# EAGLE design LittleBluePenguin (EAGLE 7.7.0)
LBP PCB Adapter board for the Intel Edison module.

## Sheet 1 of 2
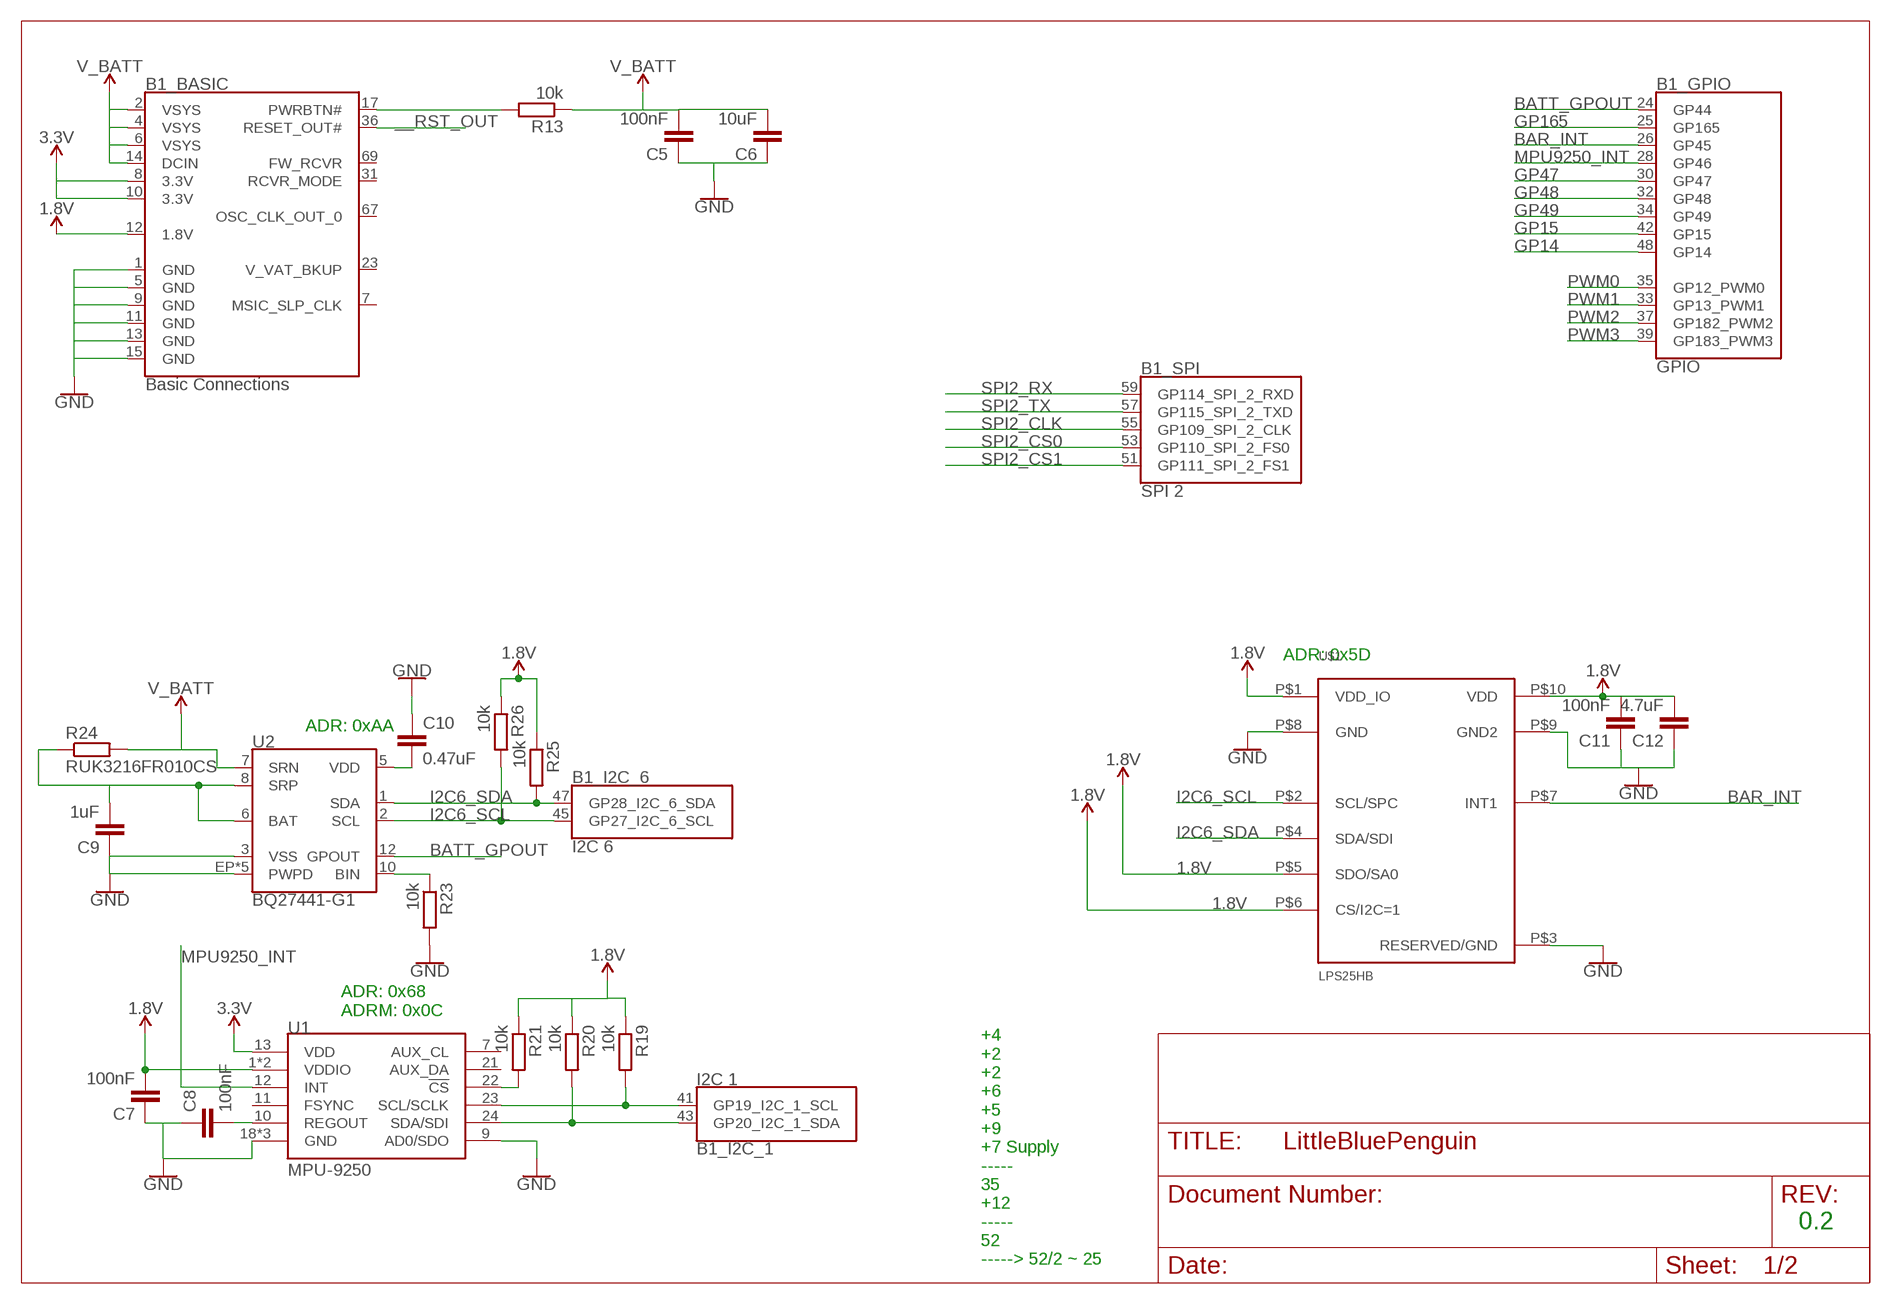
[diagram p0: schematic, sheet 1]

### Parts
B1  SPARKFUN_EDISON  [SPARKFUN_EDISON_DAUGHTER]
C5  100nF  C-EUC0603K  [C0603K]
C6  10uF  C-EUC0603K  [C0603K]
C7  100nF  C-EUC0603K  [C0603K]
C8  100nF  C-EUC0603K  [C0603K]
C9  1uF  C-EUC0603K  [C0603K]
C10  0.47uF  C-EUC0603K  [C0603K]
C11  100nF  C-EUC0603K  [C0603K]
C12  4.7uF  C-EUC0603K  [C0603K]
R13  10k  R-EU_R0603  [R0603]
R19  10k  R-EU_R0603  [R0603]
R20  10k  R-EU_R0603  [R0603]
R21  10k  R-EU_R0603  [R0603]
R23  10k  R-EU_R0603  [R0603]
R24  RUK3216FR010CS  R-EU_R1206  [R1206]
R25  10k  R-EU_R0603  [R0603]
R26  10k  R-EU_R0603  [R0603]
U1  MPU-9250  [QFN24_PAD]
U2  BQ27441-G1  [PDSO-N12]
U$1  LPS25HB  [HLGA-10L]

### Nets
1.8V: B1.12(_BASIC:1.8V) C7.2 C11.2 C12.2 R19.1 R20.1 R21.1 R25.1 R26.1 U1.1(VDDIO) U1.8(VDDIO) U$1.P$1(VDD_IO) U$1.P$5(SDO/SA0) U$1.P$6(CS/I2C=1) U$1.P$10(VDD) ; also sheet 2
3.3V: B1.8(_BASIC:3.3V) B1.10(_BASIC:3.3V) U1.13(VDD) ; also sheet 2
__RST_OUT: B1.36(_BASIC:RESET_OUT#) ; also sheet 2
BAR_INT: B1.26(_GPIO:GP45) U$1.P$7(INT1)
BATT_GPOUT: B1.24(_GPIO:GP44) U2.12(GPOUT)
BATT_IN: C9.2 R24.1 U2.6(BAT) U2.8(SRP) ; also sheet 2
GND: B1.1(_BASIC:GND) B1.5(_BASIC:GND) B1.9(_BASIC:GND) B1.11(_BASIC:GND) B1.13(_BASIC:GND) B1.15(_BASIC:GND) C5.1 C6.1 C7.1 C8.1 C9.1 C10.1 C11.1 C12.1 R23.2 U1.9(AD0/SDO) U1.18(GND) U1.20(GND) U1.CENTER(GND) U2.3(VSS) U2.EP1(PWPD) U2.EP2(PWPD) U2.EP3(PWPD) U2.EP4(PWPD) U2.EP(PWPD) U$1.P$3(RESERVED/GND) U$1.P$8(GND) U$1.P$9(GND2) ; also sheet 2
GP14: B1.48(_GPIO:GP14)
GP15: B1.42(_GPIO:GP15)
GP47: B1.30(_GPIO:GP47)
GP48: B1.32(_GPIO:GP48)
GP49: B1.34(_GPIO:GP49)
GP165: B1.25(_GPIO:GP165)
I2C1_SCL: B1.41(_I2C_1:GP19_I2C_1_SCL) R19.2 U1.23(SCL/SCLK)
I2C1_SDA: B1.43(_I2C_1:GP20_I2C_1_SDA) R20.2 U1.24(SDA/SDI)
I2C6_SCL: B1.45(_I2C_6:GP27_I2C_6_SCL) R26.2 U2.2(SCL) U$1.P$2(SCL/SPC) ; also sheet 2
I2C6_SDA: B1.47(_I2C_6:GP28_I2C_6_SDA) R25.2 U2.1(SDA) U$1.P$4(SDA/SDI) ; also sheet 2
MPU9250_INT: B1.28(_GPIO:GP46) U1.12(INT)
N$15: R23.1 U2.10(BIN)
N$16: B1.17(_BASIC:PWRBTN#) R13.2
N$17: C8.2 U1.10(REGOUT)
N$20: R21.2 U1.22(!CS)
N$22: C10.2 U2.5(VDD)
PWM0: B1.35(_GPIO:GP12_PWM0) ; also sheet 2
PWM1: B1.33(_GPIO:GP13_PWM1) ; also sheet 2
PWM2: B1.37(_GPIO:GP182_PWM2) ; also sheet 2
PWM3: B1.39(_GPIO:GP183_PWM3) ; also sheet 2
SPI2_CLK: B1.55(_SPI:GP109_SPI_2_CLK)
SPI2_CS0: B1.53(_SPI:GP110_SPI_2_FS0)
SPI2_CS1: B1.51(_SPI:GP111_SPI_2_FS1)
SPI2_RX: B1.59(_SPI:GP114_SPI_2_RXD)
SPI2_TX: B1.57(_SPI:GP115_SPI_2_TXD)
V_BATT: B1.2(_BASIC:VSYS) B1.4(_BASIC:VSYS) B1.6(_BASIC:VSYS) B1.14(_BASIC:DCIN) C5.2 C6.2 R13.1 R24.2 U2.7(SRN) ; also sheet 2
Unconnected: B1.7(_BASIC:MSIC_SLP_CLK) B1.31(_BASIC:RCVR_MODE) B1.67(_BASIC:OSC_CLK_OUT_0) B1.69(_BASIC:FW_RCVR) U1.7(AUX_CL) U1.11(FSYNC) U1.21(AUX_DA)

### Notes on the sheet
- ADR: 0x5D
- ADR: 0xAA
- ADR: 0x68
  ADRM: 0x0C
- 0.2
- +4
  +2
  +2
  +6
  +5
  +9
  +7 Supply
  -----
  35
  +12
  -----
  52
  -----> 52/2 ~ 25

## Sheet 2 of 2
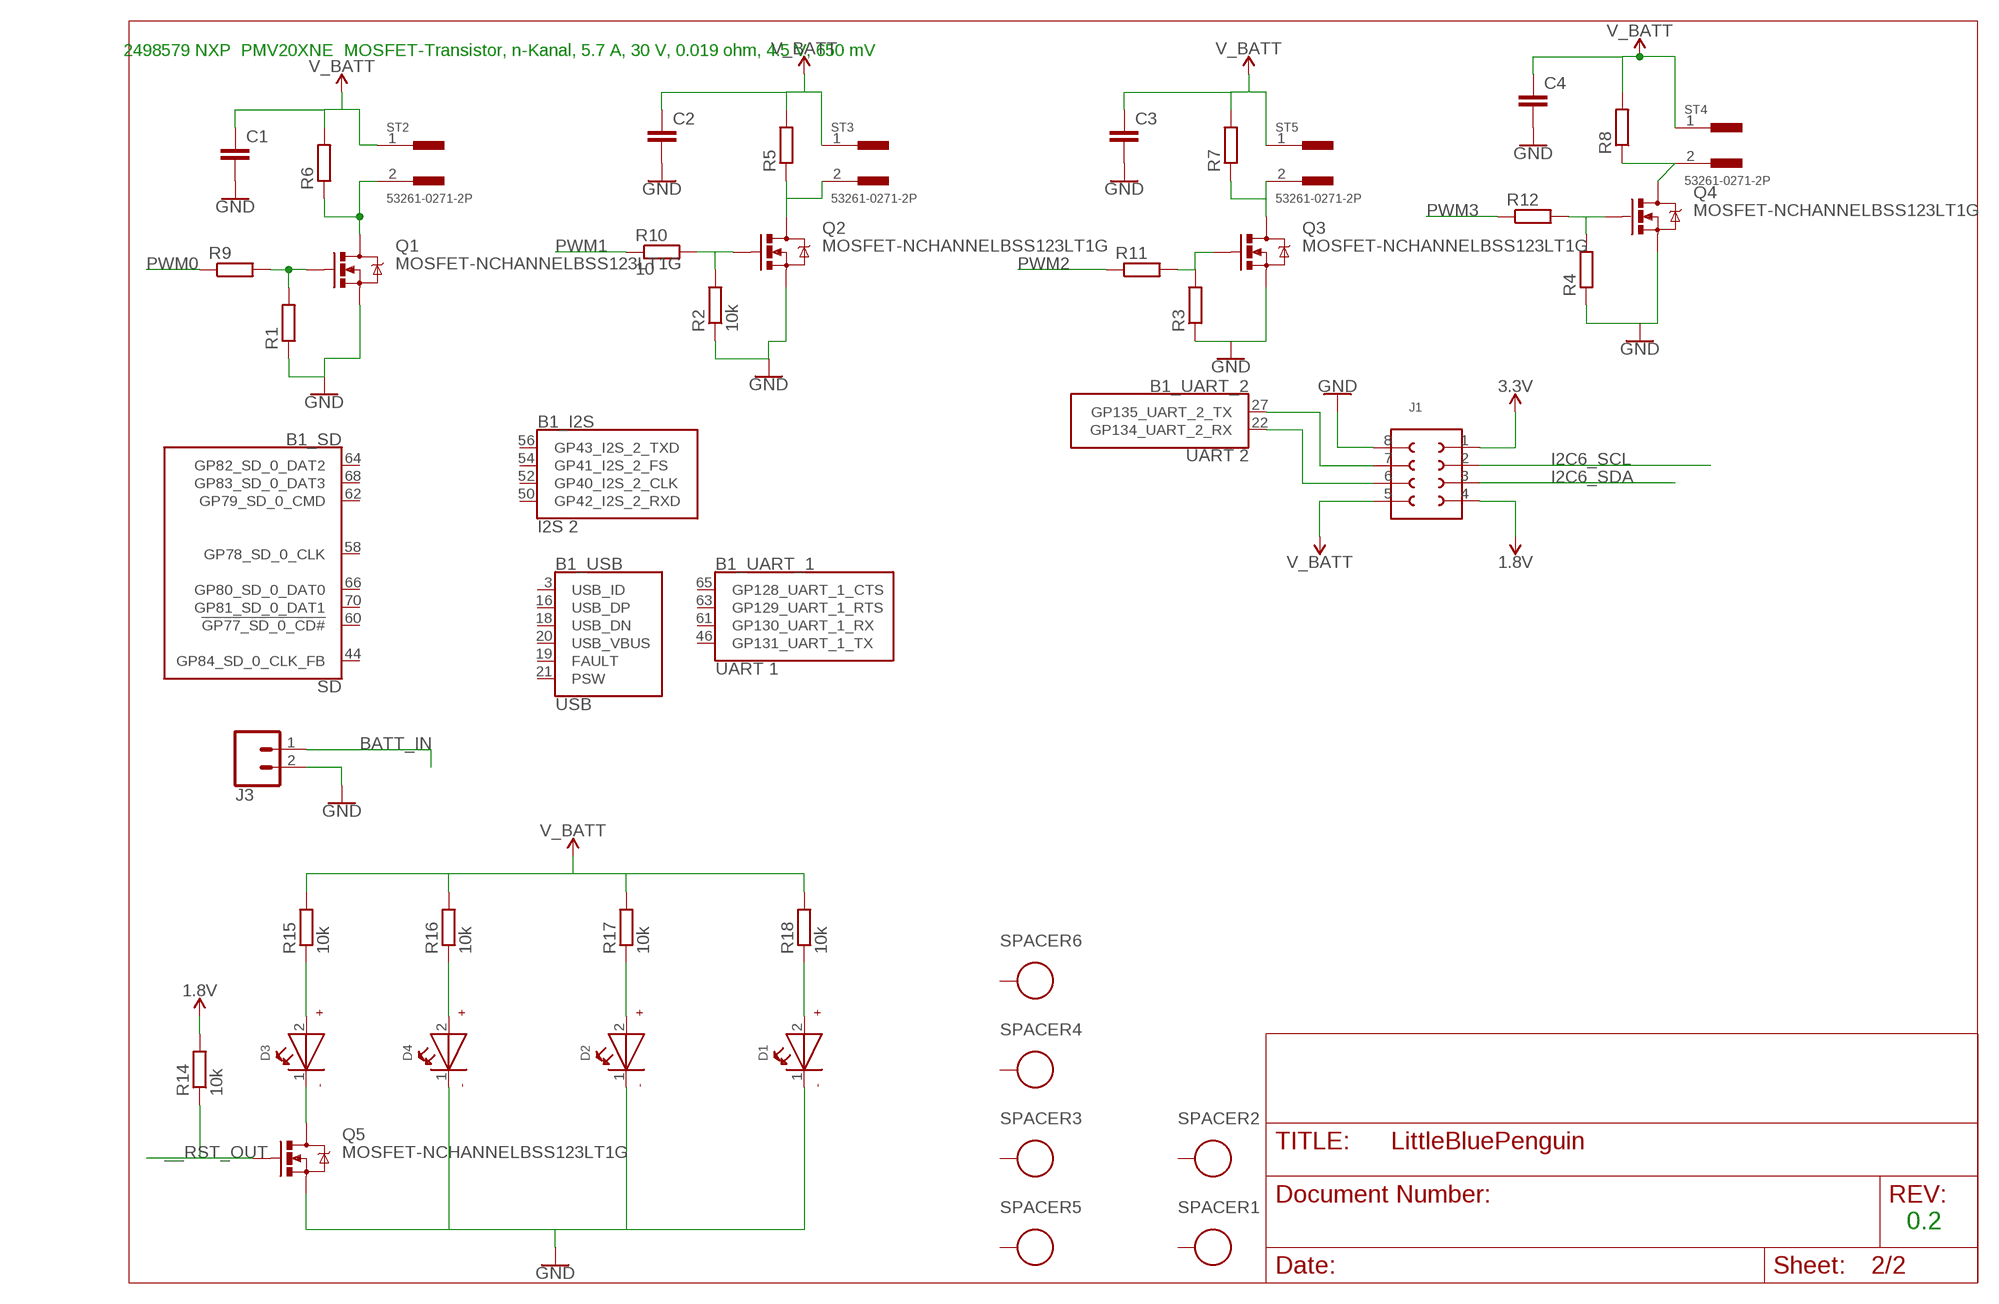
[diagram p1: schematic, sheet 2]

### Parts
C1  C-EUC0603K  [C0603K]
C2  C-EUC0603K  [C0603K]
C3  C-EUC0603K  [C0603K]
C4  C-EUC0603K  [C0603K]
D1  WL-SMSW155124GS73200-G  [1204]
D2  WL-SMSW155124GS73200-G  [1204]
D3  WL-SMSW155124GS73200-G  [1204]
D4  WL-SMSW155124GS73200-G  [1204]
J1  623X0821021  [623X0821021]
J3  CONN_02JST-PTH-2  [JST-2-PTH]
Q1  MOSFET-NCHANNELBSS123LT1G  [SOT23-3]
Q2  MOSFET-NCHANNELBSS123LT1G  [SOT23-3]
Q3  MOSFET-NCHANNELBSS123LT1G  [SOT23-3]
Q4  MOSFET-NCHANNELBSS123LT1G  [SOT23-3]
Q5  MOSFET-NCHANNELBSS123LT1G  [SOT23-3]
R1  R-EU_R0603  [R0603]
R2  10k  R-EU_R0603  [R0603]
R3  R-EU_R0603  [R0603]
R4  R-EU_R0603  [R0603]
R5  R-EU_R0603  [R0603]
R6  R-EU_R0603  [R0603]
R7  R-EU_R0603  [R0603]
R8  R-EU_R0603  [R0603]
R9  R-EU_R0603  [R0603]
R10  10  R-EU_R0603  [R0603]
R11  R-EU_R0603  [R0603]
R12  R-EU_R0603  [R0603]
R14  10k  R-EU_R0603  [R0603]
R15  10k  R-EU_R0603  [R0603]
R16  10k  R-EU_R0603  [R0603]
R17  10k  R-EU_R0603  [R0603]
R18  10k  R-EU_R0603  [R0603]
SPACER1  WA-SMSI_9774243  [WA-SMSI_9774***243]
SPACER2  WA-SMSI_9774243  [WA-SMSI_9774***243]
SPACER3  WA-SMSI_9774360  [WA-SMSI_9774***360]
SPACER4  WA-SMSI_9774360  [WA-SMSI_9774***360]
SPACER5  WA-SMSI_9774360  [WA-SMSI_9774***360]
SPACER6  WA-SMSI_9774360  [WA-SMSI_9774***360]
ST2  53261-0271-2P  [53261-0271]
ST3  53261-0271-2P  [53261-0271]
ST4  53261-0271-2P  [53261-0271]
ST5  53261-0271-2P  [53261-0271]

### Nets
1.8V: J1.4 R14.2 ; also sheet 1
3.3V: J1.1 ; also sheet 1
__RST_OUT: Q5.1(G) R14.1 ; also sheet 1
BATT_IN: J3.1 ; also sheet 1
GND: C1.2 C2.2 C3.2 C4.2 D1.1(-) D2.1(-) D4.1(-) J1.8 J3.2 Q1.2(S) Q2.2(S) Q3.2(S) Q4.2(S) Q5.2(S) R1.1 R2.1 R3.1 R4.1 ; also sheet 1
I2C6_SCL: J1.2 ; also sheet 1
I2C6_SDA: J1.3 ; also sheet 1
N$1: Q3.1(G) R3.2 R11.2
N$2: Q1.3(D) R6.1 ST2.2
N$3: D3.1(-) Q5.3(D)
N$4: D3.2(+) R15.1
N$5: Q1.1(G) R1.2 R9.2
N$6: Q2.1(G) R2.2 R10.2
N$7: Q3.3(D) R7.1 ST5.2
N$8: Q2.3(D) R5.1 ST3.2
N$9: D4.2(+) R16.1
N$10: D2.2(+) R17.1
N$11: Q4.1(G) R4.2 R12.2
N$12: Q4.3(D) R8.1 ST4.2
N$14: D1.2(+) R18.1
N$50: B1.27(_UART_2:GP135_UART_2_TX) J1.7
N$51: B1.22(_UART_2:GP134_UART_2_RX) J1.6
PWM0: R9.1 ; also sheet 1
PWM1: R10.1 ; also sheet 1
PWM2: R11.1 ; also sheet 1
PWM3: R12.1 ; also sheet 1
V_BATT: C1.1 C2.1 C3.1 C4.1 J1.5 R5.2 R6.2 R7.2 R8.2 R15.2 R16.2 R17.2 R18.2 ST2.1 ST3.1 ST4.1 ST5.1 ; also sheet 1
Unconnected: B1.3(_USB:USB_ID) B1.16(_USB:USB_DP) B1.18(_USB:USB_DN) B1.19(_USB:FAULT) B1.20(_USB:USB_VBUS) B1.21(_USB:PSW) B1.44(_SD:GP84_SD_0_CLK_FB) B1.46(_UART_1:GP131_UART_1_TX) B1.50(_I2S:GP42_I2S_2_RXD) B1.52(_I2S:GP40_I2S_2_CLK) B1.54(_I2S:GP41_I2S_2_FS) B1.56(_I2S:GP43_I2S_2_TXD) B1.58(_SD:GP78_SD_0_CLK) B1.60(_SD:!GP77_SD_0_CD#) B1.61(_UART_1:GP130_UART_1_RX) B1.62(_SD:GP79_SD_0_CMD) B1.63(_UART_1:GP129_UART_1_RTS) B1.64(_SD:GP82_SD_0_DAT2) B1.65(_UART_1:GP128_UART_1_CTS) B1.66(_SD:GP80_SD_0_DAT0) B1.68(_SD:GP83_SD_0_DAT3) B1.70(_SD:GP81_SD_0_DAT1) SPACER1.1 SPACER2.1 SPACER3.1 SPACER4.1 SPACER5.1 SPACER6.1

### Notes on the sheet
- 2498579 NXP  PMV20XNE  MOSFET-Transistor, n-Kanal, 5.7 A, 30 V, 0.019 ohm, 4.5 V, 650 mV
- 0.2

## Power pins joined to a net without a drawn wire
V_VAT_BKUP: B1.23(_BASIC:V_VAT_BKUP)

## Library data of the parts
B1 = SparkFun-Boards:SPARKFUN_EDISON: SparkFun Edison The Intel® Edison is an ultra small computing platform that will change the way you look at embedded electronics. Each Edison packs a huge amount of tech goodies into a tiny package while still providing the same robust strength of your go-to single board computer. Powered by the Intel® Atom™ SoC dual-core CPU and including an integrated WiFi, Bluetooth LE, and a 70-pin connector to attach a veritable slew of shield-like “Blocks” which can be stacked on top of each other. This device includes footprints for the Edison module itself, as well as the basic board outline used for our Edison blocks. SparkFun Products: Intel Edison <https://www.sparkfun.com/products/13024> SparkFun Console Block <https://www.sparkfun.com/products/13039> SparkFun GPIO Block <https://www.sparkfun.com/products/13038> SparkFun Battery Block <https://www.sparkfun.com/products/13037> SparkFun Base Block <https://www.sparkfun.com/products/13045> SparkFun 9DOF Block <https://www.sparkfun.com/products/13033> SparkFun OLED Block <https://www.sparkfun.com/products/13035> SparkFun Dual H-Bridge Block <https://www.sparkfun.com/products/13043> SparkFun microSD Block <https://www.sparkfun.com/products/13041> SparkFun ADC Block <https://www.sparkfun.com/products/13770> SparkFun I2C Block <https://www.sparkfun.com/products/13034> SparkFun Arduino Block <https://www.sparkfun.com/products/13036> SparkFun Power Block <https://www.sparkfun.com/products/13727> SparkFun PWM Block <https://www.sparkfun.com/products/13042> SparkFun Raspberry Pi Block <https://www.sparkfun.com/products/13044> SparkFun UART Block <https://www.sparkfun.com/products/13040>
C1-C12 = rcl:C-EU: CAPACITOR, European symbol
D1-D4 = EAGLE-COLOR_LED-rev16a:WL-SMSW: SMD Side view mono-color round Characteristics Low power consumption High reliability Low current requirement No UV/IR radiation Wide viewing angle Excelllent for edge lighting displays and backlighting indicators Ideal for miniature applications PBC high-usage Compatible with automatic placement equipment Applications Backlighting for LCD Sidelighting applications Indicator and backlighting for telecommunication Backlighting for symbol, switch and dashboard General use <http://katalog.we-online.de/media/images/eipal/WL-SMSW_pf2.jpg> Details see: http://katalog.we-online.de/en/led/WL-SMSW?m Updated: 2015-04-10 2015 (C) Wurth Elektronik; COMPANY-URL: http://www.we-online.de; CREATED-BY: Christin Otto; CREATED-DATE: APR 2013; DATASHEET-URL: http://katalog.we-online.de/en/led/WL-SMSW?m=t&sq=smsw&sp=&sp=http%3A%2F%2Fwww.we-online.de%2Fweb%2Fen%2Felectronic_components%2Fsearchpage_PBS.php%3Fsearch%3Dsmsw#vs_t2:2; MANUFACTURER: Würth Elektronik eiSos GmbH
J1 = EAGLE-BOARD-TO-BOARD_CONNECTORS-rev16c:623X0821021: WR-PHD 1.27mm Dual SMT Socket Header H=4.50mm, 8 Pins=>Code : Con_BTB_SHD_1.27_2_623x0821021(Packaging:x = 0: Tube x = 3: Tape & Reel with Cap) <http://katalog.we-online.de/media/thumbs2/eican/thb_Con_BTB_SHD_1.27_2_6230xx21021_pf2.jpg> 6230xx21021 Details see: http://katalog.we-online.de/en/em/PHD_1_27_SMT_DUAL_SOCKET_HEADER_6230XX21021 6233xx21021 Details see: http://katalog.we-online.de/en/em/PHD_1_27_SMT_DUAL_SOCKET_HEADER_REEL_6233XX21021 2014 (C) Würth Elektronik
J3 = SparkFun-Connectors:CONN_02: Multi connection point. Often used as Generic Header-pin footprint for 0.1 inch spaced/style header connections On any of the 0.1 inch spaced packages, you can populate with these: Break Away Headers - Straight <https://www.sparkfun.com/products/116> (PRT-00116) Break Away Male Headers - Right Angle <https://www.sparkfun.com/products/553> (PRT-00553) Female Headers <https://www.sparkfun.com/products/115> (PRT-00115) Break Away Headers - Machine Pin <https://www.sparkfun.com/products/117> (PRT-00117) Break Away Female Headers - Swiss Machine Pin <https://www.sparkfun.com/products/743> (PRT-00743) For SCREWTERMINALS and SPRING TERMINALS visit here: Screw Terimnals on SparkFun.com <https://www.sparkfun.com/search/results?term=Screw+Terminals> (5mm/3.5mm/2.54mm spacing) This device is also useful as a general connection point to wire up your design to another part of your project. Our various solder wires solder well into these plated through hole pads. Hook-Up Wire - Assortment (Stranded, 22 AWG) <https://www.sparkfun.com/products/11375> (PRT-11375) Hook-Up Wire - Assortment (Solid Core, 22 AWG) <https://www.sparkfun.com/products/11367> (PRT-11367) View the entire wire category on our website here <https://www.sparkfun.com/categories/141> Special notes: Molex polarized connector foot print use with: PRT-08233 with associated crimp pins and housings. 2.54_SCREWTERM for use with PRT-10571. 3.5mm Screw Terminal footprints for PRT-08084 5mm Screw Terminal footprints for use with PRT-08432; PROD_ID: CONN-09863; SKU: PRT-09914
Q1-Q5 = SparkFun-DiscreteSemi:MOSFET-NCHANNEL: Common NMOSFET Parts MFG P/N Store ID Prod ID FDD8780 TRANS-09984 SI7820DN TRANS-11055 FDS6630A IC-08089 2N7002PW TRANS-11151 FQP30N06L COM-10213 TRANS-10060 BSS123LT1G TRANS-08345 BSS138 TRANS-00830 BS170 2N7000; PROD_ID: TRANS-08345
R1-R21 R23-R26 = rcl:R-EU_: RESISTOR, European symbol
SPACER1 SPACER2 = EAGLE-SPACER_STUDS_&_ROUND_SPACERS_1-rev16b:WA-SMSI_9774***243: WA-SMSI SMT Steel Spacer, M2 Thread Internal Characteristics Thread M2 Material:Steel Surface:Tin Outer Diameter 4.35 mm Inner Diameter 2.7 mm <http://katalog.we-online.de/media/images/v2/Single_SMD-Abstandsbolzen(3).jpg> Details see: http://katalog.we-online.de/en/em/SMSI_SMT_STEEL_SPACER_M2_THREAD_INTERNAL/S 2015 (C) Wurth Elektronik
SPACER3-SPACER6 = EAGLE-SPACER_STUDS_&_ROUND_SPACERS_1-rev16b:WA-SMSI_9774***360: WA-SMSI SMT Steel Spacer, M3 Thread Internal Characteristics Thread M3 Material:Steel Surface:Tin Outer Diameter 6 mm Inner Diameter 4.2 mm <http://katalog.we-online.de/media/images/v2/Single_SMD-Abstandsbolzen(3).jpg> Details see: http://katalog.we-online.de/en/em/SMSI_SMT_STEEL_SPACER_M3_THREAD_INTERNAL/S 2015 (C) Wurth Elektronik
ST2-ST5 = H-Molex:53261-0271-2P: PicoBlade 53261 / RM1.25mm /mates with 51021 Series
U1 = SparkFun_MPU-9250_Breakout:MPU-9250: NC pin 19. 2-6 & 14-17 not internally connected. May be used for PCB trace routing.; PROD_ID: IC-13192
U2 = battery-management-temp:BQ27441-G1
U$1 = 0_st_LPS25HB:LPS25HB: LPS25HB Digi-Key: 497-15070-1-ND

## Board
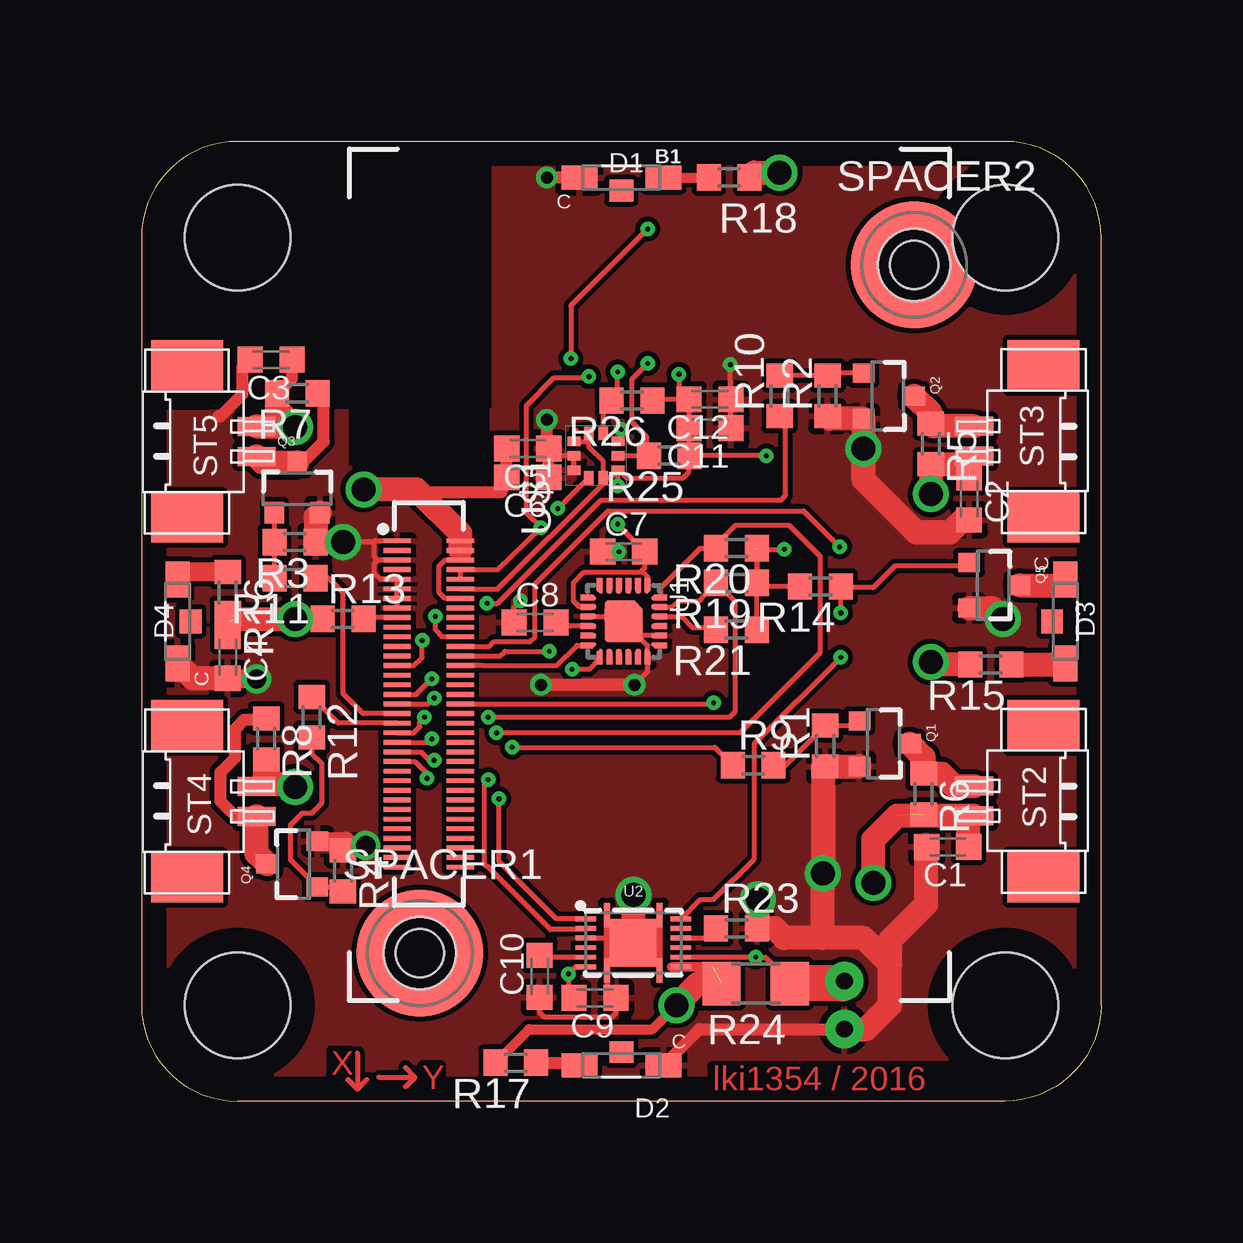
[diagram p2: board, top side]
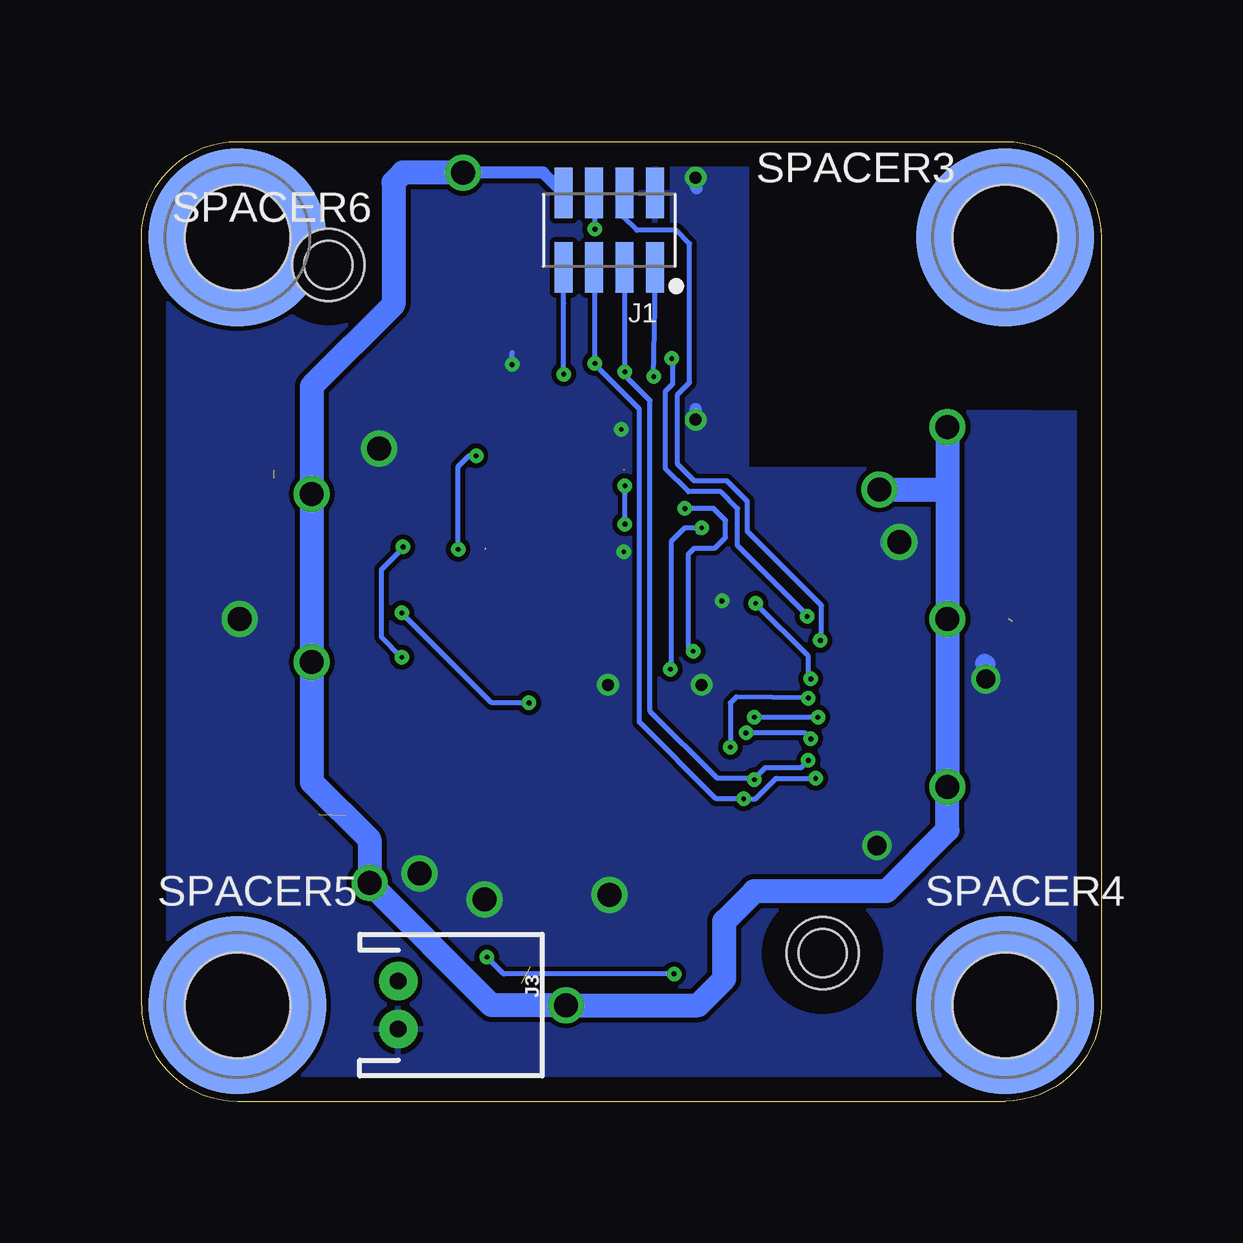
[diagram p3: board, bottom side, seen from below]

Size 40 x 40 mm. Coordinates in mm from the lower left corner, seen from the top.
Outline: 0,36 0,4 arc90 4,0 36,0 arc90 40,4 40,36 arc90 36,40 4,40 arc90 0,36
Copper layers (1*16): Top 0.035mm / dielectric 1.5mm / Bottom 0.035mm
Design rules "default *": minimum track width 0.1mm, minimum drill 0.1mm, track to track 8mil, track to pad 8mil, pad to pad 8mil, via to via 8mil, smd to smd 8mil, copper to edge 40mil, drill to drill 8mil, minimum pad ring 10mil, minimum via ring 8mil, stop-mask expansion 4mil, vias tented up to drill 0mil, thermal gap 10mil
tRestrict: area 8.6,26.5 to 14.5,39.9
bRestrict: area 8.5,26.4 to 14.6,39.9

### Footprints (pad centres in the part's own frame; a part is rotated, then mirrored left to right if it is on the bottom)
SPARKFUN_EDISON_DAUGHTER = smd 1.14 x 0.2: 1 -11.99,1.39; 2 -9.35,1.39; 3 -11.99,0.99; 4 -9.35,0.99; 5 -11.99,0.59; 6 -9.35,0.59; 7 -11.99,0.19; 8 -9.35,0.19; 9 -11.99,-0.21; 10 -9.35,-0.21; 11 -11.99,-0.61; 12 -9.35,-0.61; 13 -11.99,-1.01; 14 -9.35,-1.01; 15 -11.99,-1.41; 16 -9.35,-1.41; 17 -11.99,-1.81; 18 -9.35,-1.81; 19 -11.99,-2.21; 20 -9.35,-2.21; 21 -11.99,-2.61; 22 -9.35,-2.61; 23 -11.99,-3.01; 24 -9.35,-3.01; 25 -11.99,-3.41; 26 -9.35,-3.41; 27 -11.99,-3.81; 28 -9.35,-3.81; 29 -11.99,-4.21; 30 -9.35,-4.21; 31 -11.99,-4.61; 32 -9.35,-4.61; 33 -11.99,-5.01; 34 -9.35,-5.01; 35 -11.99,-5.41; 36 -9.35,-5.41; 37 -11.99,-5.81; 38 -9.35,-5.81; 39 -11.99,-6.21; 40 -9.35,-6.21; 41 -11.99,-6.61; 42 -9.35,-6.61; 43 -11.99,-7.01; 44 -9.35,-7.01; 45 -11.99,-7.41; 46 -9.35,-7.41; 47 -11.99,-7.81; 48 -9.35,-7.81; 49 -11.99,-8.21; 50 -9.35,-8.21; 51 -11.99,-8.61; 52 -9.35,-8.61; 53 -11.99,-9.01; 54 -9.35,-9.01; 55 -11.99,-9.41; 56 -9.35,-9.41; 57 -11.99,-9.81; 58 -9.35,-9.81; 59 -11.99,-10.21; 60 -9.35,-10.21; 61 -11.99,-10.61; 62 -9.35,-10.61; 63 -11.99,-11.01; 64 -9.35,-11.01; 65 -11.99,-11.41; 66 -9.35,-11.41; 67 -11.99,-11.81; 68 -9.35,-11.81; 69 -11.99,-12.21; 70 -9.35,-12.21 | hole 2: 9.56,12.89; -11.04,-15.8
C0603K = smd 1.05 x 1.08: 1 -0.875,0; 2 0.875,0
1204 = smd 1.5 x 1: 1 -1.75,0; 2 1.75,0 | smd 1 x 0.9: 3 0,-0.55
623X0821021 = smd 0.75 x 2.1: 1 -1.905,1.55; 2 -0.635,1.55; 3 0.635,1.55; 4 1.905,1.55; 5 1.905,-1.55; 6 0.635,-1.55; 7 -0.635,-1.55; 8 -1.905,-1.55
JST-2-PTH = drill 0.7 pad 1.6: 1 -1,0; 2 1,0
SOT23-3 = smd 0.8 x 0.9: 1 -0.95,-1; 2 0.95,-1; 3 0,1.1
R0603 = smd 1 x 1.1: 1 -0.85,0; 2 0.85,0
R1206 = smd 1.6 x 1.803: 1 -1.422,0; 2 1.422,0
WA-SMSI_9774***243 = smd 5.3 x 5.3: 1 0,0 | hole 3: 0,0
WA-SMSI_9774***360 = smd 7.4 x 7.4: 1 0,0 | hole 4.4: 0,0
53261-0271 = smd 0.8 x 1.6: 1 -0.62,1.8; 2 0.63,1.8 | smd 2.1 x 3: 3 -3.16,-1.1; 4 3.17,-1.1
QFN24_PAD = smd 0.5 x 0.25: 1 -1.55,1; 2 -1.55,0.6; 3 -1.55,0.2; 4 -1.55,-0.2; 5 -1.55,-0.6; 6 -1.55,-1; 13 1.55,-1; 14 1.55,-0.6; 15 1.55,-0.2; 16 1.55,0.2; 17 1.55,0.6; 18 1.55,1 | smd 0.08 x 0.13: 1$1 -1.32,1.06; 1$3 -1.26,0.94; P$33 1.26,-0.94; P$34 1.32,-1.06; P$58 1.26,0.94; P$59 1.32,1.06; P$68 -1.26,-0.94; P$69 -1.32,-1.06 | smd 0.1 x 0.185 rotated 45: 1$2 -1.25,1.024; P$49 1.024,-1.25 | smd 0.14 x 0.14: 1$4 -1.22,0.945; P$23 -0.945,-1.22; P$24 1.22,-0.945; P$36 0.945,1.22; P$51 0.945,-1.22; P$56 1.22,0.945; P$61 -0.945,1.22; P$66 -1.22,-0.945 | smd 0.05 x 0.05: 1$5 -1.175,0.97; P$25 -0.97,-1.175; P$31 1.175,-0.97; P$37 0.97,1.175; P$52 0.97,-1.175; P$57 1.175,0.97; P$62 -0.97,1.175; P$67 -1.175,-0.97 | smd 0.25 x 0.5: 7 -1,-1.55; 8 -0.6,-1.55; 9 -0.2,-1.55; 10 0.2,-1.55; 11 0.6,-1.55; 12 1,-1.55; 19 1,1.55; 20 0.6,1.55; 21 0.2,1.55; 22 -0.2,1.55; 23 -0.6,1.55; 24 -1,1.55 | smd 0.25 x 0.25: CENTER 0,0 | smd 0.4 x 0.4: DBBADFE -0.675,0.24 | smd 0.6 x 1.2: DBBADFE1 -0.575,-0.195 | smd 0.25 x 0.3: P$1 -0.2,1.3; P$3 0.2,1.3; P$5 0.6,1.3; P$11 -0.6,1.3; P$16 0.2,-1.3; P$18 -0.2,-1.3; P$20 -0.6,-1.3; P$26 0.6,-1.3 | smd 0.3 x 0.25: P$2 -1.3,0.2; P$4 -1.3,0.6; P$28 -1.3,-0.2; P$38 -1.3,-0.6; P$40 1.3,0.2; P$42 1.3,-0.2; P$44 1.3,-0.6; P$50 1.3,0.6 | smd 0.1 x 0.185 rotated 225: P$7 1.25,-1.024; P$60 -1.024,1.25 | smd 1.1 x 1.59: P$13 0.325,0 | smd 0.3 x 0.5 rotated 315: P$14 -0.592,0.512 | smd 0.5 x 1.59: P$15 -0.27,0 | smd 0.1 x 0.185 rotated 135: P$22 -1.024,-1.25; P$55 1.25,1.024 | smd 0.13 x 0.08: P$27 -0.94,-1.26; P$29 -1.06,-1.32; P$39 0.94,1.26; P$41 1.06,1.32; P$53 0.94,-1.26; P$54 1.06,-1.32; P$63 -0.94,1.26; P$64 -1.06,1.32 | smd 0.1 x 0.185 rotated 315: P$35 1.024,1.25; P$65 -1.25,-1.024
PDSO-N12 = smd 0.2 x 0.85: 1 -1,-1.975; 2 -0.6,-1.975; 3 -0.2,-1.975; 4 0.2,-1.975; 5 0.6,-1.975; 6 1,-1.975; 7 1,1.975; 8 0.6,1.975; 9 0.2,1.975; 10 -0.2,1.975; 11 -0.6,1.975; 12 -1,1.975 | smd 1.95 x 1.95: EP 0,0 | smd 1 x 0.25: EP1 -1.15,1.1; EP2 -1.15,-1.1; EP3 1.15,-1.1; EP4 1.15,1.1
HLGA-10L = smd 0.55 x 0.4: P$1 2.17,1.55; P$2 2.17,0.95; P$6 0.33,0.95; P$7 0.33,1.55 | smd 0.4 x 0.55: P$3 1.85,0.33; P$4 1.25,0.33; P$5 0.65,0.33; P$8 0.65,2.17; P$9 1.25,2.17; P$10 1.85,2.17

### Placement (x,y rotation side)
B1  22.64,21.96 0 top
C1  33.6,10.6 180 top
C2  34.5,25.1 270 top
C3  5.4,30.9 180 top
C4  3.6,18.5 270 top
C5  16.1,27.2 180 top
C6  16.1,26 180 top
C7  20.1,22.9 0 top
C8  16.4,19.95 0 top
C9  18.9,4.3 180 top
C10  16.6,5.2 90 top
C11  23.7,28.05 180 top
C12  23.7,29.25 180 top
D1  20,38.5 0 top
D2  20,1.5 180 top
D3  38.5,20 270 top
D4  1.5,20 90 top
J1  20.5,36.3 180 bottom
J3  29.3,4 270 bottom
Q1  30.93,14.9 270 top
Q2  31.1,29.39 270 top
Q3  6.49,25.52 0 top
Q4  6.34,9.88 90 top
Q5  35.5,21.5 270 top
R1  28.5,14.8 90 top
R2  28.6,29.4 90 top
R3  6.4,23.3 180 top
R4  8.4,9.6 270 top
R5  32.9,27.4 270 top
R6  32.6,12.8 270 top
R7  6.5,29.5 180 top
R8  5.2,15.1 270 top
R9  25.5,14 0 top
R10  26.6,29.4 90 top
R11  6.4,21.8 180 top
R12  7.1,16 270 top
R13  8.4,20.1 0 top
R14  28.3,21.45 180 top
R15  35.4,18.2 180 top
R16  3.6,21.2 270 top
R17  15.6,1.6 180 top
R18  24.5,38.5 0 top
R19  24.8,21.6 180 top
R20  24.8,23.05 180 top
R21  24.8,19.65 180 top
R23  24.8,7.2 0 top
R24  25.6,4.9 180 top
R25  22,26.9 180 top
R26  20.45,29.2 180 top
SPACER1  11.61,6.16 0 top
SPACER2  32.21,34.85 0 top
SPACER3  4,36 0 bottom
SPACER4  4,4 0 bottom
SPACER5  36,4 0 bottom
SPACER6  36,36 0 bottom
ST2  36.5,12.5 90 top
ST3  36.5,27.5 90 top
ST4  3,12.5 270 top
ST5  3,27.5 270 top
U1  20.1,20 270 top
U2  20.5,6.6 270 top
U$1  20.2,25.65 90 top

### Tracks (layer width: path | path; a pad name or v marks a point on that pad's centre or on a via)
1.8V  (via drill 0.2)  (2 unrouted)
  Top 0.2: B1.12 14.85,21.35 19.25,25.75 U$1.P$6 | U$1.P$6 19.55,25.98 U$1.P$5 19.87,25.67 v19.85,25.65 | U$1.P$6 19.25,26.65 18.65,27.25 U$1.P$1 18.65,27.5 U$1.P$10 | C12.2 C11.2 22.85,28.02 R25.1 | R20.1 R19.1 | R14.2 25.65,21.45 | R21.1 25.65,21.45 | 25.65,21.45 25.65,23 v26.8,23 | v26.05,26.9 R25.1 | 19.9,26.3 20.25,25.95 22.55,25.95 22.8,26.2 22.8,26.55 22.85,26.6 R25.1 | C12.2 21.15,29.25 R26.1 | U1.8 18.25,20.6 18,20.85 18,21.6 18.45,22.05 20.8,22.05 | 20.8,22.05 20.98,22.23 C7.2 19.85,24.02 v19.85,24.05 | 20.8,22.05 20.9,22.05 21.1,21.85 U1.1 | v22.4,30.3 22.4,29.68 C12.2
  Bottom 0.2: v26.8,23 26.8,26.45 26.35,26.9 v26.05,26.9 | v22.4,30.3 22.41,33.24 J1.4 | v19.85,24.05 v19.85,25.65
3.3V  (via drill 0.2)
  Top 0.2: 18.6,30 v18.65,30.2 18.6,30.15 17.2,30.15 16.05,29 16.05,24.5 v16.65,23.9 14.85,22.15 B1.8 B1.10 | U1.13 18.65,18 v17.95,18
  Bottom 0.2: 16.8,23.7 16.7,23.8 v16.65,23.9 17.35,23.9 17.9,23.35 17.9,18.05 v17.95,18 | v18.65,30.2 18.59,33.1 J1.1
__RST_OUT  (via drill 0.2)
  Top 0.2: Q5.1 34.35,22.3 31.4,22.3 30.5,21.4 29.2,21.4 R14.1 v29.15,20.35 | B1.36 23.8,16.55 v23.85,16.6
  Bottom 0.2: v23.85,16.6 25.4,16.6 v29.15,20.35
BAR_INT  (via drill 0.2)
  Top 0.2: B1.26 14.95,18.55 15.15,18.75 v17,18.75 | v17.35,24.7 17.37,24.7 U$1.P$7
  Bottom 0.2: v17,18.75 17.2,18.95 17.2,22.8 16.95,23.05 16.1,23.05 15.65,23.5 15.65,24.2 16.15,24.7 v17.35,24.7
BATT_GPOUT  (via drill 0.2)
  Top 0.2: B1.24 14.5,18.95 14.7,19.15 16.2,19.15 16.4,19.35 16.4,21.55 19.45,24.6 27.6,24.6 v29.1,23.1 | U2.12 22.5,7.6 23.3,8.4 23.85,8.4 25.55,10.1 25.55,14.9 v29.15,18.5
  Bottom 0.2: v29.15,18.5 30,19.35 30,22.15 29.1,23.05 v29.1,23.1
BATT_IN  (via drill 0.2)
  Top 0.2: U2.6 18.1,5.6 v17.8,5.3 17.8,4.53 C9.2 | U2.8 v25.6,6 26,6 26.5,5.5 26.5,5.42 R24.1
  Top 1.5: J3.1 29.2,4.9 R24.1
  Bottom 0.2: v17.8,5.3 24.9,5.3 v25.6,6
GND  (via drill 0.2, 0.5, 0.8, 1)
  Top 0.2: U2.3 19.4,6.8 | 19.4,6.8 20.15,6.8 20.2,6.75 20.2,7.1 20.45,7.35 20.45,8.55 v20.5,8.6 | B1.15 B1.13 B1.11 B1.9 9.95,21.75 9.7,22 9.7,22.4 9.85,22.55 B1.5 9.85,22.55 9.7,22.7 9.7,23.32 | 9.7,23.32 9.69,23.33 9.66,23.3 v8.4,23.3 | B1.1 9.73,23.35 9.7,23.32 | U1.9 20.1,20.2 U1.CENTER 20.7,19.4 | C12.1 C11.1 24.55,28.07 v24.55,30.7 | U$1.P$3 20,27.63 v20,28 | C8.1 15.53,20.57 v15.8,20.85 | U$1.P$8 U$1.P$9 16.98,26.9 C5.1 17.27,26.9 | U1.20 20.7,19.4 | 20.7,19.4 21.1,19 U1.18 21.1,17.9 v20.55,17.35 | U2.EP1 21.6,7.25 21.55,7.2 20.5,7.2 | U2.EP2 19.4,6.8 | 19.4,6.8 U2.EP3 19.4,4.67 C9.1 19.77,3.67 19.6,3.5 16.8,3.5 16.6,3.7 C10.1 | U2.EP4 21.6,5.9 20.9,6.6 U2.EP | C7.1 v19.9,22.9
  Top 0.5: D1.1 v16.9,38.5 | v20.55,17.35 v16.65,17.35 | v16.9,28.4 16.9,26.98 16.98,26.9 C5.1 C6.1 | D2.1 23.25,3 J3.2 | C3.2 4.2,30.57 4.2,29.45 3.3,28.55 3.2,28.55
  Top 0.8: v9.35,10.65 8.4,10.7 R4.1 8.52,10.83 Q4.2 | C4.2 4.78,17.62 v4.8,17.6
  Top 1: J3.2 30.2,3 31.2,4 31.2,5.7 | 31.2,5.7 30.1,6.8 28.4,6.8 | 28.4,6.8 26.8,6.8 26.4,7.2 25.7,7.2 | R23.2 25.7,7.2 | 25.7,7.2 v25.7,8.4 | U2.EP 20.5,7.2 v20.5,8.6 | C4.2 2.12,17.62 D4.1 | C1.2 32.7,10.57 32.7,8.2 31.2,6.7 31.2,5.7 | 28.4,6.8 v28.4,9.5 28.4,13.85 arc-90 R1.1 Q1.2 | Q5.2 35.45,20.55 v35.9,20.1 | R2.1 28.71,28.44 Q2.2 v30.1,27.2 30.1,25.9 32.3,23.7 33.7,23.7 34.23,24.23 C2.2 | Q3.2 7.25,24.33 R3.1 v8.4,23.3
  Bottom 0.2: v20,28 20,28.1 | v15.8,20.85 15.85,21.05 | v24.55,30.7 24.55,31.2 | v19.9,22.9 19.95,22.95
  Bottom 0.5: v16.9,38.5 16.9,38.1 16.85,38.05 | v16.9,28.4 16.9,28.85
  Bottom 0.8: v9.35,10.65 9.1,10.65 9.15,10.7 | v4.8,17.6 4.8,18.2 4.85,18.25
  Bottom 1: v25.7,8.4 25.5,8.4 | v20.5,8.6 20.5,8.7 20.4,8.8 | v28.4,9.5 28.4,9.2 | v35.9,20.1 36,20 | v30.1,27.2 30.1,27.1 | v8.4,23.3 8.7,23.3
  pour Bottom: 0,-0.05 40,-0.05 40,40 14.7,40.05 14.7,28.8 -0.05,28.7
  pour Top: 0.2,0.05 40,0.05 40,39.95 14.7,40.05 14.7,28.8 0,28.7 0,0
I2C1_SCL  (via drill 0.2)
  Top 0.2: B1.41 11.35,15.35 11.6,15.6 11.6,15.8 v11.8,16 | U1.23 22.1,20.6 22.4,20.85 23.25,20.85 R19.2 | 23.9,21.55 R19.2 | v14.45,16 24.5,16 24.75,16.25 24.75,20.8 R19.2
  Bottom 0.2: v11.8,16 v14.45,16
I2C1_SDA  (via drill 0.2)
  Top 0.2: U1.24 21.65,21.4 23.3,23.05 R20.2 23.95,23.2 24.75,24 27,24 28.3,22.7 28.3,18.7 24.95,15.35 v14.8,15.35 | B1.43 11.95,14.95 v12.1,15.1
  Bottom 0.2: 14.7,15.45 v14.8,15.35 12.35,15.35 v12.1,15.1
I2C6_SCL  (via drill 0.2)
  Top 0.2: B1.45 11.65,14.55 12,14.2 v12.2,14.2 | U$1.P$2 19.25,28.85 R26.2 19.85,29.45 v19.85,30.4 | U2.2 18.48,7.15 17.05,7.15 14.4,9.8 arc-90 14.3,9.9 14.3,13.25 v14.45,13.4
  Bottom 0.2: v14.45,13.4 14.45,13.45 | v12.2,14.2 12.5,13.9 14,13.9 14.45,13.45 | v19.85,30.4 19.85,34.2 19.86,34.22 J1.2 | 14.45,13.45 16,13.45 18.8,16.25 18.8,29.2 19.85,30.25 v19.85,30.4 | 19.85,30.55 v19.85,30.4
I2C6_SDA  (via drill 0.2)
  Top 0.2: U2.1 17.3,7.6 14.9,10 v14.9,12.6 | U$1.P$4 R25.2 21.05,27 21.05,27.7 20.45,28.3 20.45,30.1 v21.1,30.75 | B1.47 11.4,14.15 11.9,13.65 v11.9,13.45
  Bottom 0.2: 12,13.35 v11.9,13.45 13.55,13.45 14.4,12.6 v14.9,12.6 16.05,12.6 19.25,15.8 19.25,28.85 21.1,30.7 v21.1,30.75 21.1,33.85 21.14,33.88 J1.3
MPU9250_INT
  Top 0.2: 18.5,19 U1.12 18.15,19 17.3,18.15 14.25,18.15 B1.28
N$1
  Top 0.2: R11.2 R3.2 Q3.1
N$2
  Top 1: ST2.2 33.87,13.13 33.35,13.65 R6.1 32.6,14.33 Q1.3
N$3
  Top 1: Q5.3 38.25,21.5 D3.1
N$4
  Top 1: R15.1 38.45,18.2 D3.2
N$5
  Top 0.2: R9.2 26.85,14 R1.2 29.73,15.65 Q1.1
N$6
  Top 0.2: Q2.1 28.69,30.34 R2.2 R10.2
N$7
  Top 0.5: Q3.3 6.72,26.62 7.6,27.5 7.6,29.25 R7.1
  Top 1: ST5.2 5.05,26.62 Q3.3
N$8
  Top 1: ST3.2 33.02,28.13 R5.1 32.9,28.69 Q2.3
N$9
  Top 0.8: R16.1 1.8,22.05 D4.2
N$10
  Top 0.5: R17.1 18.15,1.6 D2.2
N$11
  Top 0.2: R12.2 7.1,14.5 7.5,14.1 7.5,12.4 7.1,12 6.7,12 6.2,11.5 6.2,10.07 Q4.1 8.48,8.93 R4.2
N$12
  Top 0.5: ST4.2 3.93,11.87 3.3,12.5 3.3,13.7 3.9,14.3 3.9,15.5 4.3,15.9 5.15,15.9 R8.1
  Top 1: Q4.3 4.8,10.32 ST4.2
N$13
  Top 0.2: 9.9,1 11.4,1 | 11.4,1 11,1.4 | 11.4,1 11,0.6
N$14
  Top 0.406: D1.2 R18.1
N$15
  Top 0.2: U2.10 23.55,6.8 R23.1
N$16
  Top 0.2: B1.17 9.3,20.15 R13.2
N$17
  Top 0.2: U1.10 17.88,19.8 C8.2
N$18
  Top 0.2: 9,2 9,0.5 | 9,0.5 9.4,0.9 | 9,0.5 8.6,0.9
N$20
  Top 0.2: U1.22 22.5,20.2 22.95,19.75 23.85,19.75 R21.2
N$22
  Top 0.2: U2.5 17.18,6 C10.2
N$50  (via drill 0.2)
  Top 0.2: B1.27 11.35,18.15 11.7,18.5 v11.7,19.2
  Bottom 0.2: 19.85,37.84 J1.7 19.9,37.81 19.9,36.85 19.35,36.3 17.7,36.3 17.15,35.75 17.15,29.95 17.65,29.45 17.65,26.55 16.95,25.85 15.6,25.85 14.75,25 14.75,23.75 11.65,20.65 11.65,19.25 v11.7,19.2
N$51  (via drill 0.2)
  Top 0.2: B1.22 12.55,19.35 12.25,19.65 v12.25,20.2 | 17.9,31.05 v17.9,30.95 17.9,33.15 v21.1,36.35
  Bottom 0.2: v12.25,20.2 12.25,20.25 15.15,23.15 15.15,24.7 15.85,25.4 17.2,25.4 18.15,26.35 18.15,29.6 17.85,29.9 17.85,30.9 v17.9,30.95 | v21.1,36.35 21.1,37.2 21.2,37.3
  Bottom 0.5: 21.2,37.3 21.14,37.37 J1.6
PWM0  (via drill 0.2)
  Top 0.2: B1.35 11.95,16.55 v12.2,16.8 | v15.45,14.75 23.9,14.75 R9.1
  Bottom 0.2: v12.2,16.8 15.2,16.85 15.45,16.6 v15.45,14.75
PWM1  (via drill 0.2)
  Top 0.2: B1.33 11.45,16.95 v12.1,17.6 | 26.25,28.2 R10.1 26.85,28.3 26.85,25.25 26.65,25.05 19.15,25.05 14.85,20.75 v14.4,20.75
  Bottom 0.2: v12.1,17.6 12.2,17.6 12.2,18.55 v14.4,20.75
PWM2
  Top 0.2: B1.37 9.25,16.15 8.4,17 8.4,21.2 7.8,21.8 R11.1
PWM3
  Top 0.2: B1.39 8.2,15.75 R12.1
V_BATT  (via drill 1)  (4 unrouted)
  Top 0.2: 34.25,26.55 34.37,26.55 ST3.1 | 5.1,13.2 5.1,13.42 ST4.1 | R13.1 v6.4,20.1 | B1.14 12.65,20.95 12.4,21.2 12.4,22.3 12.65,22.55 B1.6 B1.4
  Top 0.4: 23.8,5.6 U2.7 22.1,5.6
  Top 0.406: R17.2 16.15,3 21.3,3 v22.3,4
  Top 0.5: 11.57,25.38 15,25.38 C6.2 C5.2 | R7.2 6.28,30.12 C3.1
  Top 1: R24.2 23.2,4.9 v22.3,4 | v30.5,9.1 30.5,10.9 31.5,11.9 34.68,11.9 ST2.1 34.48,11.65 C1.1 | 34.5,26.3 34.25,26.55 R5.2 v32.9,25.3 | R15.2 33,18.2 v32.9,18.3 | v6.4,13.1 6.4,13.2 5.1,13.2 | 5.1,13.2 5.2,13.8 | ST5.1 6.18,28.12 6.2,28.1 v6.4,28.1 5.65,28.85 R7.2 | R16.2 3.85,20.1 v6.4,20.1 | R8.2 5.1,13.2 | 5.1,13.2 5.4,13.3 | C4.1 3.6,20 3.7,20 | 5.1,13.42 5.3,13.62 5.1,13.2 | R18.2 25.55,38.7 v26.6,38.7 | v9.25,25.5 11.45,25.5 11.57,25.38 13.29,23.66 B1.2 B1.4
  Bottom 0.5: J1.5 23.25,38.7 v26.6,38.7
  Bottom 1: v6.4,28.1 6.4,25.5 | 6.4,25.5 v6.4,20.1 v6.4,13.1 6.4,11.3 8.95,8.75 14.45,8.75 15.7,7.5 15.7,5.1 16.8,4 v22.3,4 25.4,4 v30.5,9.1 30.5,10.9 32.9,13.3 v32.9,18.3 v32.9,25.3 32.9,29.8 29.5,33.2 29.5,38.3 29.1,38.7 v26.6,38.7 26.45,38.55 | v9.25,25.5 6.4,25.5

### Text on the board
Top: X | Y | lki1354 / 2016